# Altium schematic sheet ecs8a_sch_v2.SchDoc
size A4
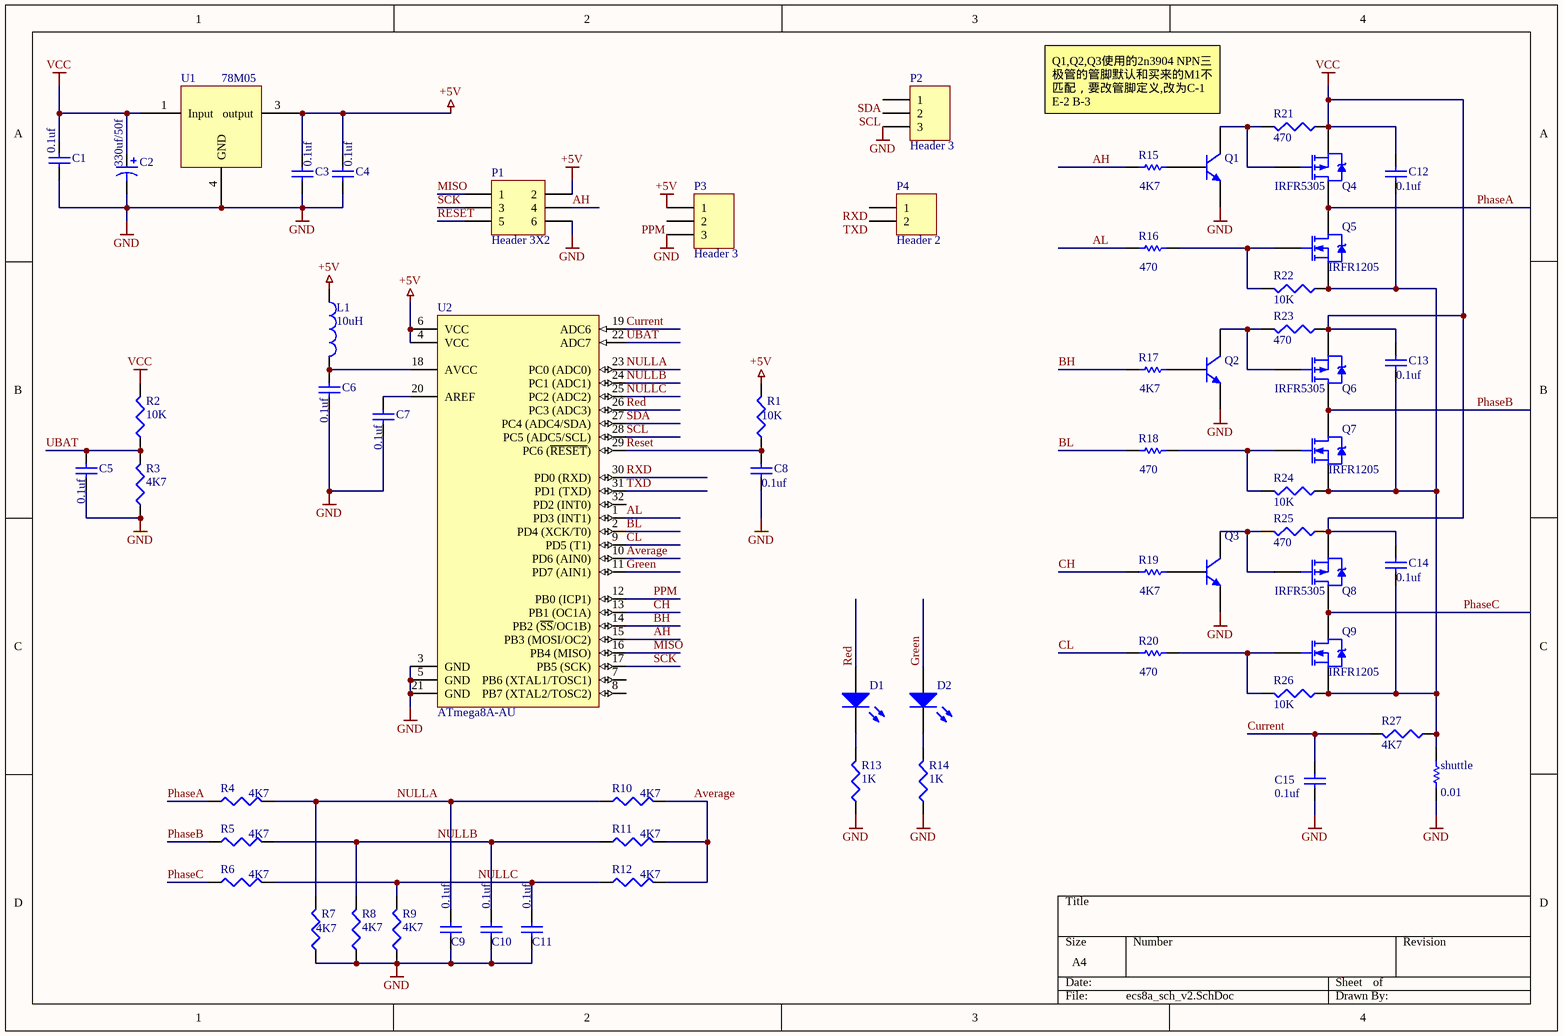
[diagram p0: ecs8a_sch_v2.SchDoc]

## Parts
C1  value 0.1uf  [6-0805_L]  (hidden comment: Cap)
C2  value 330uf/50f  [double_size_c_2]  (hidden comment: Cap Pol1)
C3  value 0.1uf  [6-0805_L]  (hidden comment: Cap)
C4  value 0.1uf  [6-0805_L]  (hidden comment: Cap)
C5  value 0.1uf  [6-0805_L]  (hidden comment: Cap)
C6  value 0.1uf  [6-0805_L]  (hidden comment: Cap)
C7  value 0.1uf  [6-0805_L]  (hidden comment: Cap)
C8  value 0.1uf  [6-0805_L]  (hidden comment: Cap)
C9  value 0.1uf  [6-0805_L]  (hidden comment: Cap)
C10  value 0.1uf  [6-0805_L]  (hidden comment: Cap)
C11  value 0.1uf  [6-0805_L]  (hidden comment: Cap)
C12  value 0.1uf  [6-0805_L]  (hidden comment: Cap)
C13  value 0.1uf  [6-0805_L]  (hidden comment: Cap)
C14  value 0.1uf  [6-0805_L]  (hidden comment: Cap)
C15  value 0.1uf  [6-0805_L]  (hidden comment: Cap)
D1  LED0  [6-0805_L]  (value not drawn)
D2  LED0  [6-0805_L]  (value not drawn)
L1  value 10uH  [6-0805_L]  (hidden comment: Inductor)
P1  Header 3X2  [HDR2X3]
P2  Header 3  [i2c_headers]
P3  Header 3  [ppm_headers]
P4  Header 2  [uart_header3]
Q1  2N3904  [SOT23_L]  (value not drawn)
Q2  2N3904  [SOT23_L]  (value not drawn)
Q3  2N3904  [SOT23_L]  (value not drawn)
Q4  IRFR5305  [TO-252AA]
Q5  IRFR1205  [TO-252AA]
Q6  IRFR5305  [TO-252AA]
Q7  IRFR1205  [TO-252AA]
Q8  IRFR5305  [TO-252AA]
Q9  IRFR1205  [TO-252AA]
R1  value 10K  [6-0805_L]  (hidden comment: Res3)
R2  value 10K  [6-0805_L]  (hidden comment: Res3)
R3  value 4K7  [6-0805_L]  (hidden comment: Res3)
R4  value 4K7  [6-0805_L]  (hidden comment: Res3)
R5  value 4K7  [6-0805_L]  (hidden comment: Res3)
R6  value 4K7  [6-0805_L]  (hidden comment: Res3)
R7  value 4K7  [6-0805_L]  (hidden comment: Res3)
R8  value 4K7  [6-0805_L]  (hidden comment: Res3)
R9  value 4K7  [6-0805_L]  (hidden comment: Res3)
R10  value 4K7  [6-0805_L]  (hidden comment: Res3)
R11  value 4K7  [6-0805_L]  (hidden comment: Res3)
R12  value 4K7  [6-0805_L]  (hidden comment: Res3)
R13  value 1K  [6-0805_L]  (hidden comment: Res3)
R14  value 1K  [6-0805_L]  (hidden comment: Res3)
R15  value 4K7  [6-0805_L]  (hidden comment: Res1)
R16  value 470  [6-0805_L]  (hidden comment: Res1)
R17  value 4K7  [6-0805_L]  (hidden comment: Res1)
R18  value 470  [6-0805_L]  (hidden comment: Res1)
R19  value 4K7  [6-0805_L]  (hidden comment: Res1)
R20  value 470  [6-0805_L]  (hidden comment: Res1)
R21  value 470  [6-0805_L]  (hidden comment: Res3)
R22  value 10K  [6-0805_L]  (hidden comment: Res3)
R23  value 470  [6-0805_L]  (hidden comment: Res3)
R24  value 10K  [6-0805_L]  (hidden comment: Res3)
R25  value 470  [6-0805_L]  (hidden comment: Res3)
R26  value 10K  [6-0805_L]  (hidden comment: Res3)
R27  value 4K7  [6-0805_L]  (hidden comment: Res3)
shuttle  value 0.01  [shuttle2]  (hidden comment: Res1)
U1  78M05  [TO-252AA]
U2  ATmega8A-AU  [32A_N]

## Nets
+5V: C3.2 C4.2 L1.1 P1.2 P3.1 R1.2 U1.3(output) U2.4(VCC) U2.6(VCC)
GND: C1.1 C2.2 C3.1 C4.1 C5.2 C6.2 C7.2 C8.1 C9.2 C10.2 C11.2 C15.1 P1.6 P2.3 P3.3 Q1.2(E) Q2.2(E) Q3.2(E) R3.1 R7.1 R8.1 R9.1 R13.1 R14.1 shuttle.1 U1.4(GND) U2.3(GND) U2.5(GND) U2.21(GND)
VCC: C1.2 C2.1 C12.2 C13.2 C14.2 Q4.3(S) Q6.3(S) Q8.3(S) R2.2 R21.1 R23.1 R25.1 U1.1(Input)
AH: P1.4 R15.2 U2.15(PB3_(MOSI/OC2))
AL: R16.2 U2.1(PD3_(INT1))
Average: R10.2 R11.2 R12.2 U2.10(PD6_(AIN0))
BH: R17.2 U2.14(PB2_(~{SS}/OC1B))
BL: R18.2 U2.2(PD4_(XCK/T0))
CH: R19.2 U2.13(PB1_(OC1A))
CL: R20.2 U2.9(PD5_(T1))
Current: C15.2 R27.2 U2.19(ADC6)
Green: D2.1(A) U2.11(PD7_(AIN1))
MISO: P1.1 U2.16(PB4_(MISO))
NULLA: C9.1 R4.2 R7.2 R10.1 U2.23(PC0_(ADC0))
NULLB: C10.1 R5.2 R8.2 R11.1 U2.24(PC1_(ADC1))
NULLC: C11.1 R6.2 R9.2 R12.1 U2.25(PC2_(ADC2))
PhaseA: Q4.4(D) Q5.4(D) R4.1
PhaseB: Q6.4(D) Q7.4(D) R5.1
PhaseC: Q8.4(D) Q9.4(D) R6.1
PPM: P3.2 U2.12(PB0_(ICP1))
Red: D1.1(A) U2.26(PC3_(ADC3))
Reset: C8.2 P1.5 R1.1 U2.29(PC6_(~{RESET}))
RXD: P4.1 U2.30(PD0_(RXD))
SCK: P1.3 U2.17(PB5_(SCK))
SCL: P2.2 U2.28(PC5_(ADC5/SCL))
SDA: P2.1 U2.27(PC4_(ADC4/SDA))
TXD: P4.2 U2.31(PD1_(TXD))
UBAT: C5.1 R2.1 R3.2 U2.22(ADC7)
NetC6_1: C6.1 L1.2 U2.18(AVCC)
NetC7_1: C7.1 U2.20(AREF)
NetC12_1: C12.1 C13.1 C14.1 Q5.3(S) Q7.3(S) Q9.3(S) R22.1 R24.1 R26.1 R27.1 shuttle.2
NetD1_2: D1.2(K) R13.2
NetD2_2: D2.2(K) R14.2
NetQ1_1: Q1.1(C) Q4.1(G) R21.2
NetQ1_3: Q1.3(B) R15.1
NetQ2_1: Q2.1(C) Q6.1(G) R23.2
NetQ2_3: Q2.3(B) R17.1
NetQ3_1: Q3.1(C) Q8.1(G) R25.2
NetQ3_3: Q3.3(B) R19.1
NetQ5_1: Q5.1(G) R16.1 R22.2
NetQ7_1: Q7.1(G) R18.1 R24.2
NetQ9_1: Q9.1(G) R20.1 R26.2

Not connected (* = marked no-connect by the designer): U2 7(PB6_(XTAL1/TOSC1)) 8(PB7_(XTAL2/TOSC2)) 32(PD2_(INT0))

## Notes on the sheet
- Q1,Q2,Q3使用的2n3904 NPN三极管的管脚默认和买来的M1不匹配，要改管脚定义,改为C-1 E-2 B-3

## Library data of the parts
C1 C3-C15 = Cap: Capacitor; Published: 8-Jun-2000; LatestRevisionDate: 17-Jul-2002; LatestRevisionNote: Re-released for DXP Platform.; PackageReference: RAD-0.3; Publisher: Altium Limited; PackageDescription: Radial Cap, Thru-Hole; 2 Leads; 0.3 in Pin Spacing
C2 = Cap Pol1: Polarized Capacitor (Radial); Published: 8-Jun-2000; LatestRevisionDate: 17-Jul-2002; LatestRevisionNote: Re-released for DXP Platform.; PackageReference: RB7.6-15; Publisher: Altium Limited; PackageDescription: Polarized Capacitor (Radial); 2 Leads
D1 D2 = LED0: Typical INFRARED GaAs LED; Published: 8-Jun-2000; LatestRevisionDate: 08-Jul-2005; LatestRevisionNote: Mech Layer 1 removed.; PackageReference: LED-0; Publisher: Altium Limited
L1 = Inductor: Code_IEC: 1005; Published: 8-Jun-2000; LatestRevisionDate: 17-Jul-2002; LatestRevisionNote: Re-released for DXP Platform.; PackageReference: 0402-A; Publisher: Altium Limited; Code_JEITA: 0402
P1 = Header 3X2: Header, 3-Pin, Dual row; LatestRevisionDate: 17-Jul-2002; LatestRevisionNote: Re-released for DXP Platform.; Publisher: Altium Limited
P2 P3 = Header 3: Header, 3-Pin; LatestRevisionDate: 17-Jul-2002; LatestRevisionNote: Re-released for DXP Platform.; Publisher: Altium Limited
P4 = Header 2: Header, 2-Pin; LatestRevisionDate: 17-Jul-2002; LatestRevisionNote: Re-released for DXP Platform.; Publisher: Altium Limited
Q1-Q3 = 2N3904: NPN General Purpose Amplifier; Published: 8-Jun-2000; LatestRevisionDate: 15-Jan-2003; LatestRevisionNote: PCB Footprint 'BCY-W3/D4.7' replaced; DatasheetVersion: 1997; PackageVersion: Sep-1998; PackageReference: TO-92A; Publisher: Altium Limited; PackageDescription: TO, Flat Index; 3 In-Line, Axial Leads; Body Dia. 4.5mm; Leads 0.51 x 0.48 mm (max); ComponentLink1Description: Manufacturer Link; ComponentLink1URL: http://www.fairchildsemi.com/; ComponentLink2Description: Datasheet; ComponentLink2URL: http://www.fairchildsemi.com/ds/2N%2F2N3904.pdf
Q4 Q6 Q8 = IRFR5305: HEXFET Power MOSFET; Manufacturer: International Rectifier; Class I: Discrete; Class II: MOSFET - Power; Note: Pin 2 is trimmed and is electrically connected to Drain.; Published: 8-Jun-2000; Revision: July-2002: Re-released for DXP Platform.; Datasheet: Latest Revision: PD-9.1402; Package Reference: TO-252AA; Publisher: Altium Limited
Q5 Q7 Q9 = IRFR1205: HEXFET Power MOSFET; Manufacturer: International Rectifier; Class I: Discrete; Class II: MOSFET - Power; Note: Pin 2 is trimmed and is electrically connected to Drain.; Published: 8-Jun-2000; Revision: July-2002: Re-released for DXP Platform.; Datasheet: Latest Revision: PD-91318B; Package Reference: TO-252AA; Publisher: Altium Limited
R1-R14 R21-R27 = Res3: Resistor; Published: 8-Jun-2000; LatestRevisionDate: 29-May-2009; LatestRevisionNote: IPC-7351 Footprint Added.; PackageReference: J1-0603; Publisher: Altium Limited; PackageDescription: Chip Resistor
R15-R20 shuttle = Res1: Resistor; Published: 8-Jun-2000; LatestRevisionDate: 17-Jul-2002; LatestRevisionNote: Re-released for DXP Platform.; PackageReference: AXIAL-0.3; Publisher: Altium Limited; PackageDescription: Axial Device, Thru-Hole; 2 Leads; 0.3 in Pin Spacing
U1 = Component_1
U2 = ATmega8A-AU: 8-bit AVR Microcontroller, 2.7-5.5V, 16MHz, 8KB Flash, 512 Bytes EEPROM, 1KB SRAM, 32-pin TQFP, Industrial Grade (-40癈 to 85癈); DatasheetVersion: revD, Feb-2011; PackageVersion: revC, Oct-2010; PackageReference: 32A; PackageDescription: 32-Lead, 7x7x1.0 mm Body, 0.8mm Lead Pitch, Thin Profile Plastic Quad Flat Package (TQFP); Code_JEDEC: MS-026-ABA; ComponentLink1Description: Manufacturer URL; ComponentLink1URL: http://www.atmel.com/; ComponentLink2Description: ATmega8A Datasheet; ComponentLink2URL: http://www.atmel.com/dyn/resources/prod_documents/doc8159.pdf; ComponentLink3Description: ATmega8A Summary; ComponentLink3URL: http://www.atmel.com/dyn/resources/prod_documents/8159S.pdf